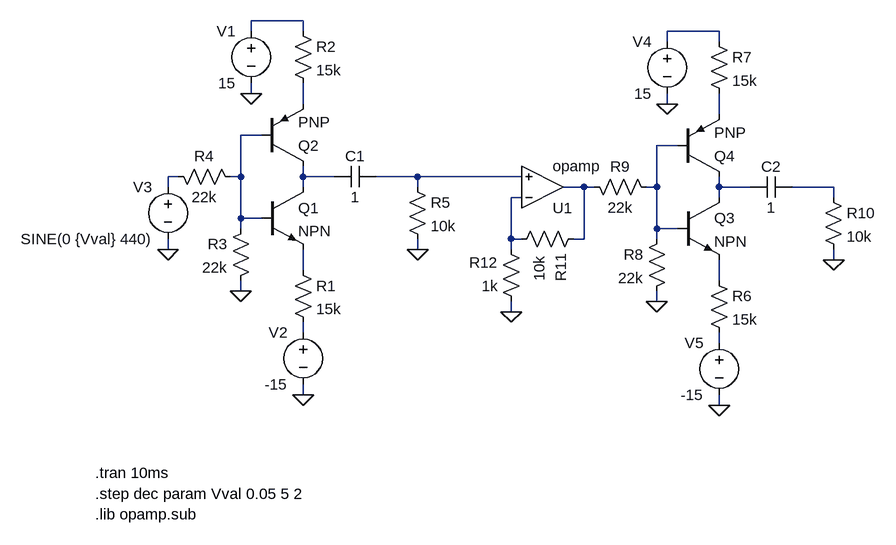
[diagram p0: schematic Wavefolder.asc]
Wavefolder.asc, the LTspice schematic file:
Version 4
SHEET 1 1416 680
WIRE 160 -160 80 -160
WIRE 80 -144 80 -160
WIRE 160 -144 160 -160
WIRE 800 -144 720 -144
WIRE 720 -128 720 -144
WIRE 800 -128 800 -144
WIRE 80 -48 80 -64
WIRE 160 -32 160 -64
WIRE 720 -32 720 -48
WIRE 800 -16 800 -48
WIRE 96 16 64 16
WIRE 736 32 704 32
WIRE -32 80 -48 80
WIRE 64 80 64 16
WIRE 64 80 48 80
WIRE 160 80 160 64
WIRE 208 80 160 80
WIRE 336 80 272 80
WIRE 496 80 336 80
WIRE -48 96 -48 80
WIRE 160 96 160 80
WIRE 336 96 336 80
WIRE 592 96 560 96
WIRE 608 96 592 96
WIRE 704 96 704 32
WIRE 704 96 688 96
WIRE 800 96 800 80
WIRE 848 96 800 96
WIRE 976 96 912 96
WIRE 496 112 480 112
WIRE 800 112 800 96
WIRE 976 112 976 96
WIRE 64 144 64 80
WIRE 96 144 64 144
WIRE 64 160 64 144
WIRE 704 160 704 96
WIRE 736 160 704 160
WIRE 480 176 480 112
WIRE 496 176 480 176
WIRE 592 176 592 96
WIRE 592 176 576 176
WIRE 704 176 704 160
WIRE -48 192 -48 176
WIRE 336 192 336 176
WIRE 480 192 480 176
WIRE 976 208 976 192
WIRE 160 224 160 192
WIRE 800 240 800 208
WIRE 64 256 64 240
WIRE 704 272 704 256
WIRE 480 288 480 272
WIRE 160 320 160 304
WIRE 800 336 800 320
WIRE 160 416 160 400
WIRE 800 432 800 416
FLAG 80 -48 0
FLAG 160 416 0
FLAG 64 256 0
FLAG -48 192 0
FLAG 336 192 0
FLAG 720 -32 0
FLAG 800 432 0
FLAG 704 272 0
FLAG 976 208 0
FLAG 480 288 0
SYMBOL npn 96 96 R0
SYMATTR InstName Q1
SYMBOL pnp 96 64 M180
SYMATTR InstName Q2
SYMBOL res 144 208 R0
SYMATTR InstName R1
SYMATTR Value 15k
SYMBOL res 144 -160 R0
SYMATTR InstName R2
SYMATTR Value 15k
SYMBOL voltage 80 -160 M0
WINDOW 123 0 0 Left 2
WINDOW 39 0 0 Left 2
SYMATTR InstName V1
SYMATTR Value 15
SYMBOL voltage 160 304 M0
WINDOW 123 0 0 Left 2
WINDOW 39 0 0 Left 2
SYMATTR InstName V2
SYMATTR Value -15
SYMBOL res 80 144 M0
SYMATTR InstName R3
SYMATTR Value 22k
SYMBOL res 64 96 M270
WINDOW 0 32 56 VTop 2
WINDOW 3 0 56 VBottom 2
SYMATTR InstName R4
SYMATTR Value 22k
SYMBOL voltage -48 80 M0
WINDOW 123 0 0 Left 2
WINDOW 39 0 0 Left 2
SYMATTR InstName V3
SYMATTR Value SINE(0 {Vval} 440)
SYMBOL res 320 80 R0
SYMATTR InstName R5
SYMATTR Value 10k
SYMBOL cap 272 64 R90
WINDOW 0 0 32 VBottom 2
WINDOW 3 32 32 VTop 2
SYMATTR InstName C1
SYMATTR Value 1
SYMBOL Opamps\\opamp 528 160 M180
SYMATTR InstName U1
SYMBOL npn 736 112 R0
SYMATTR InstName Q3
SYMBOL pnp 736 80 M180
SYMATTR InstName Q4
SYMBOL res 784 224 R0
SYMATTR InstName R6
SYMATTR Value 15k
SYMBOL res 784 -144 R0
SYMATTR InstName R7
SYMATTR Value 15k
SYMBOL voltage 720 -144 M0
WINDOW 123 0 0 Left 2
WINDOW 39 0 0 Left 2
SYMATTR InstName V4
SYMATTR Value 15
SYMBOL voltage 800 320 M0
WINDOW 123 0 0 Left 2
WINDOW 39 0 0 Left 2
SYMATTR InstName V5
SYMATTR Value -15
SYMBOL res 720 160 M0
SYMATTR InstName R8
SYMATTR Value 22k
SYMBOL res 704 112 M270
WINDOW 0 32 56 VTop 2
WINDOW 3 0 56 VBottom 2
SYMATTR InstName R9
SYMATTR Value 22k
SYMBOL res 960 96 R0
SYMATTR InstName R10
SYMATTR Value 10k
SYMBOL cap 912 80 R90
WINDOW 0 0 32 VBottom 2
WINDOW 3 32 32 VTop 2
SYMATTR InstName C2
SYMATTR Value 1
SYMBOL res 592 160 R90
WINDOW 0 60 51 Bottom 2
WINDOW 3 62 53 Top 2
SYMATTR InstName R11
SYMATTR Value 10k
SYMBOL res 496 288 R180
WINDOW 0 36 76 Left 2
WINDOW 3 36 40 Left 2
SYMATTR InstName R12
SYMATTR Value 1k
TEXT -160 536 Left 2 !.tran 10ms
TEXT -160 568 Left 2 !.step dec param Vval 0.05 5 2
TEXT -160 600 Left 2 !.lib opamp.sub

The netlist it stands for:
* Wavefolder.asc
Q1 N008 N005 N014 0 NPN
Q2 N008 N005 N003 0 PNP
R1 N014 N016 15k
R2 N001 N003 15k
V1 N001 0 15
V2 N016 0 -15
R3 N005 0 22k
R4 N005 N007 22k
V3 N007 0 SINE(0 {Vval} 440)
R5 N009 0 10k
C1 N009 N008 1
XU1 N013 N009 N010 opamp Aol=100K GBW=10Meg  ; pins invin noninvin out
Q3 N011 N006 N015 0 NPN
Q4 N011 N006 N004 0 PNP
R6 N015 N017 15k
R7 N002 N004 15k
V4 N002 0 15
V5 N017 0 -15
R8 N006 0 22k
R9 N006 N010 22k
R10 N012 0 10k
C2 N012 N011 1
R11 N010 N013 10k
R12 0 N013 1k
.model NPN NPN
.model PNP PNP
.lib standard.bjt
.tran 10ms
.step dec param Vval 0.05 5 2
.lib opamp.sub
.backanno
.end